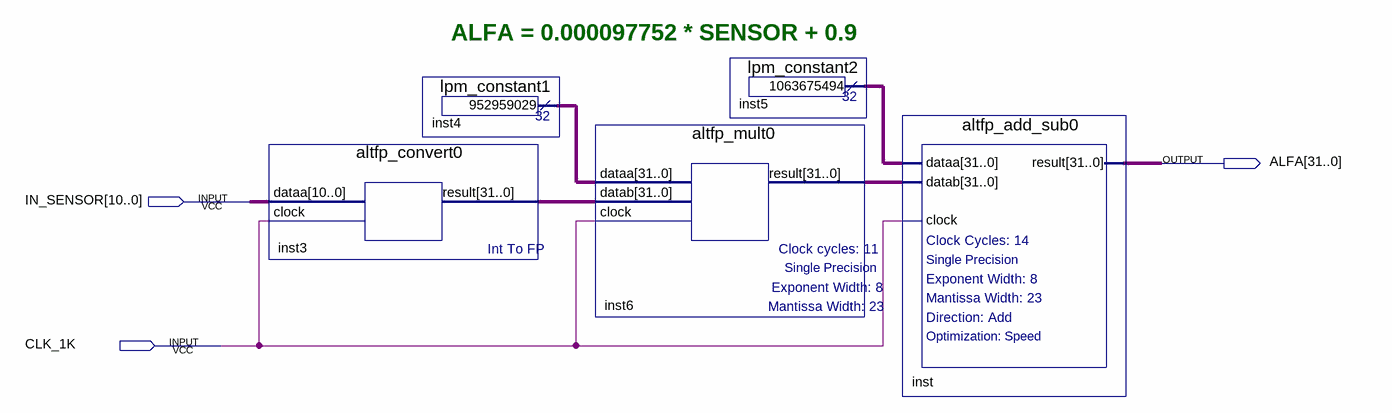
[diagram p0: schematic sheet]
// Quartus schematic alfa.bdf as structural Verilog: 5 symbols, 3 pins
module alfa (
  input  [10:0] IN_SENSOR,
  input  CLK_1K,
  output [31:0] ALFA
);

  wire [31:0] inst3_result, inst4_result, inst5_result, inst6_result;

  altfp_convert0 inst3 (.dataa(IN_SENSOR), .clock(CLK_1K), .result(inst3_result));
  lpm_constant1 inst4 (.result(inst4_result));
  altfp_mult0 inst6 (.dataa(inst4_result), .datab(inst3_result), .clock(CLK_1K), .result(inst6_result));
  lpm_constant2 inst5 (.result(inst5_result));
  altfp_add_sub0 inst (.dataa(inst5_result), .datab(inst6_result), .clock(CLK_1K), .result(ALFA));

  // Notes on the sheet:
  //   ALFA = 0.000097752 * SENSOR + 0.9
endmodule
